# EAGLE design Atmega32u2.breakout (EAGLE 6.1)
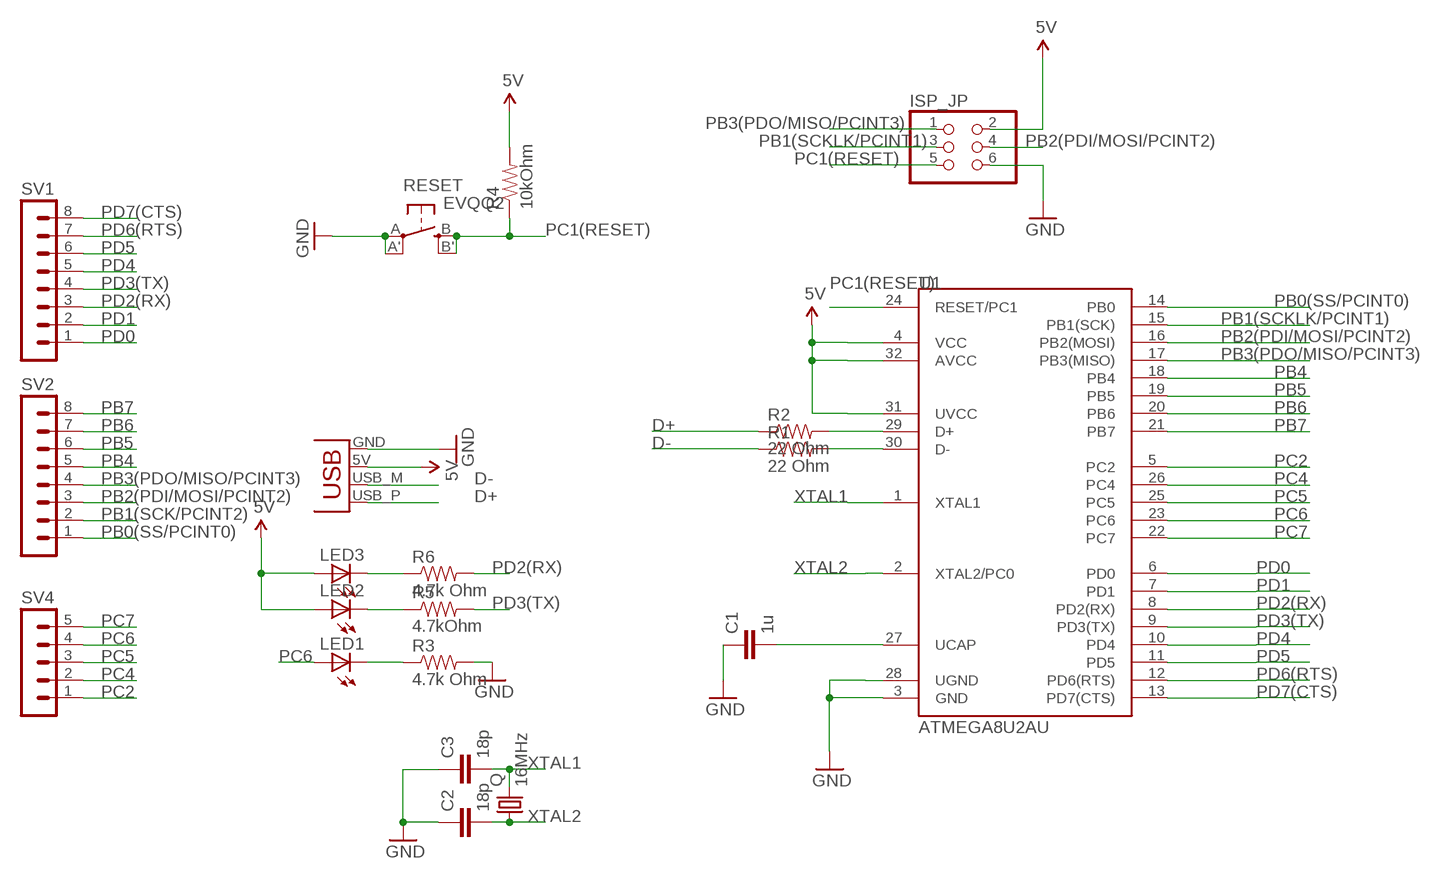
[diagram p0: schematic, sheet 1]

## Parts
C1  1u  CAP0805  [0805]
C2  18p  CAP0805  [0805]
C3  18p  CAP0805  [0805]
ISP_JP  PINHD-2X3  [2X03]
LED1  LED0603  [LED-0603]
LED2  LED0603  [LED-0603]
LED3  LED0603  [LED-0603]
Q  16MHz  CRYSTALHC49US  [HC49US]
R1  22 Ohm  RESISTOR  [0805]
R2  22 Ohm  RESISTOR  [0805]
R3  4.7k Ohm  RESISTOR  [0805]
R4  10kOhm  RESISTOR  [0805]
R5  4.7kOhm  RESISTOR  [0805]
R6  4.7k Ohm  RESISTOR  [0805]
RESET  EVQQ2  [EVQ-Q2]
SV1  MA08-1  [MA08-1]
SV2  MA08-1  [MA08-1]
SV4  MA05-1  [MA05-1]
U1  ATMEGA8U2AU  [TQFP32-08]
X1  USBPCB  [USB-A-PCB]

## Nets
5V: ISP_JP.2 LED2.A LED3.A R4.2 U1.4(VCC) U1.31(UVCC) U1.32(AVCC) X1.5V(VBUS)
D+: R2.1 X1.USB_P(D+)
D-: R1.1 X1.USB_M(D-)
GND: C1.1 C2.1 C3.1 ISP_JP.6 R3.2 RESET.A'(P1) RESET.A(P) U1.3(GND) U1.28(UGND) X1.GND
N$1: R2.2 U1.29(D+)
N$2: R1.2 U1.30(D-)
N$3: C1.2 U1.27(UCAP)
N$4: LED3.C R6.1
N$5: LED2.C R5.1
N$12: LED1.C R3.1
PB0(SS/PCINT0): SV2.1 U1.14(PB0)
PB1(SCK/PCINT2): SV2.2
PB1(SCKLK/PCINT1): ISP_JP.3 U1.15(PB1(SCK))
PB2(PDI/MOSI/PCINT2): ISP_JP.4 SV2.3 U1.16(PB2(MOSI))
PB3(PDO/MISO/PCINT3): ISP_JP.1 SV2.4 U1.17(PB3(MISO))
PB4: SV2.5 U1.18(PB4)
PB5: SV2.6 U1.19(PB5)
PB6: SV2.7 U1.20(PB6)
PB7: SV2.8 U1.21(PB7)
PC1(RESET): ISP_JP.5 R4.1 RESET.B'(S1) RESET.B(S) U1.24(RESET/PC1)
PC2: SV4.1 U1.5(PC2)
PC4: SV4.2 U1.26(PC4)
PC5: SV4.3 U1.25(PC5)
PC6: LED1.A SV4.4 U1.23(PC6)
PC7: SV4.5 U1.22(PC7)
PD0: SV1.1 U1.6(PD0)
PD1: SV1.2 U1.7(PD1)
PD2(RX): R6.2 SV1.3 U1.8(PD2(RX))
PD3(TX): R5.2 SV1.4 U1.9(PD3(TX))
PD4: SV1.5 U1.10(PD4)
PD5: SV1.6 U1.11(PD5)
PD6(RTS): SV1.7 U1.12(PD6(RTS))
PD7(CTS): SV1.8 U1.13(PD7(CTS))
XTAL1: C3.2 Q.2 U1.1(XTAL1)
XTAL2: C2.2 Q.1 U1.2(XTAL2/PC0)

## Library data of the parts
C1-C3 = SparkFun:CAP: Capacitor Standard 0603 ceramic capacitor, and 0.1" leaded capacitor.
ISP_JP = SparkFun:PINHD-2X3: PIN HEADER
LED1-LED3 = SparkFun:LED: LEDs Standard schematic elements and footprints for 5mm, 3mm, 1206, and 0603 sized LEDs. 5mm - Spark Fun Electronics SKU : COM-00529 (and others)
Q = SparkFun:CRYSTAL: Crystals Various standard crystals. Proven footprints. Spark Fun Electronics SKU : COM-00534
R1-R6 = SparkFun:RESISTOR: Resistor Basic schematic elements and footprints for 0603, 1206, and PTH 1/10th watt (small) resistors.
RESET = adaprog:EVQQ2
SV1 SV2 = con-lstb:MA08-1: PIN HEADER; OC_FARNELL: unknown; OC_NEWARK: unknown
SV4 = con-lstb:MA05-1: PIN HEADER; OC_FARNELL: unknown; OC_NEWARK: unknown
U1 = SparkFun:ATMEGA8U2: Atmel 8-bit Microcontroller with 8/16/32K Bystes of ISP Flash and USB Controller. ATmega8U2, ATmega16U2, and ATmega32U2
X1 = SparkFun:USB: USB Connectors USB-B-PTH is fully proven SKU : PRT-00139 USB-miniB is fully proven SKU : PRT-00587 USB-A-PCB is untested. USB-A-H is throughly reviewed, but untested. Spark Fun Electronics SKU : PRT-00437 USB-B-SMT is throughly reviewed, but untested. Needs silkscreen touching up. USB-A-S has not been used/tested USB-MB-H has not been used/tested

## Board
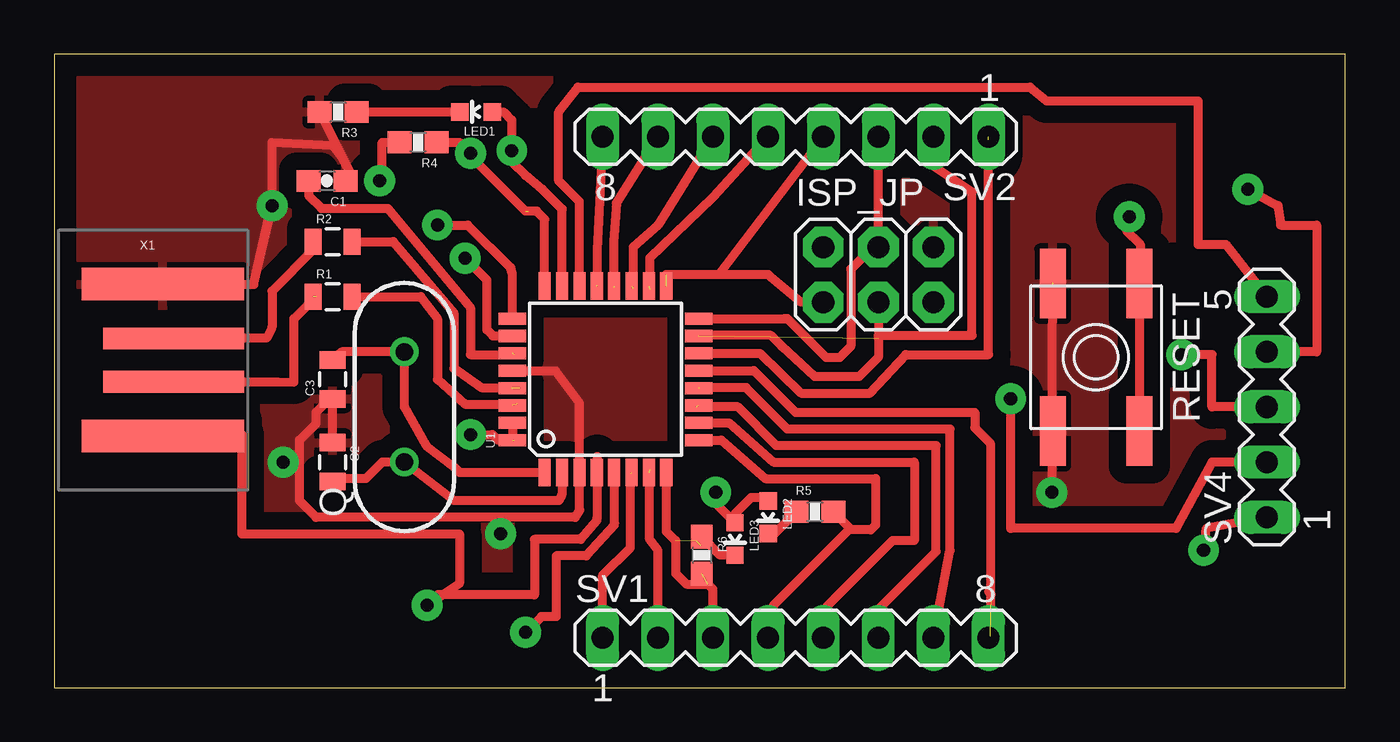
[diagram p1: board, top side]
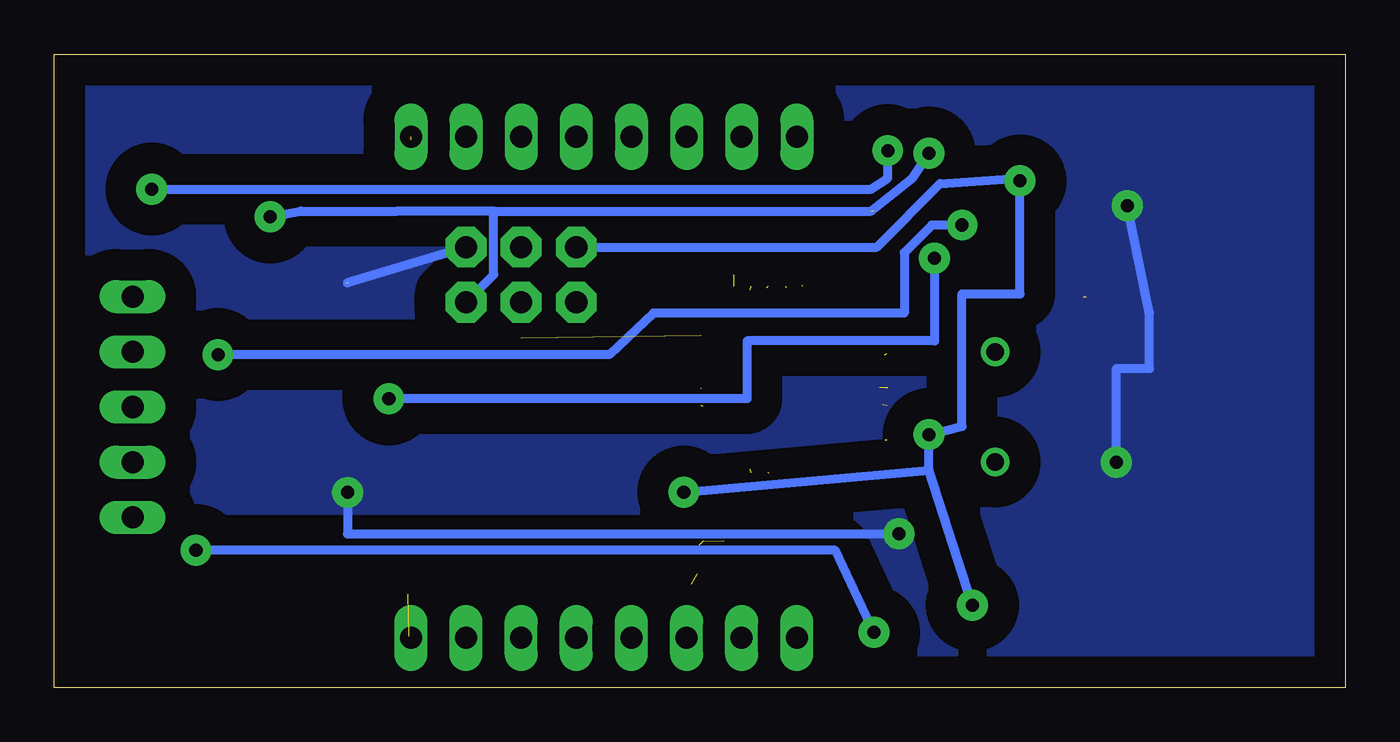
[diagram p2: board, bottom side, seen from below]

Size 59.49 x 29.18 mm. Coordinates in mm from the lower left corner, seen from the top.
Outline: 0,0 59.49,0 59.49,29.18 0,29.18 0,0
Copper layers (1*16): Top 0.035mm / dielectric 1.5mm / Bottom 0.035mm
Design rules: minimum track width 10mil, minimum drill 24mil, track to track 8mil, track to pad 8mil, pad to pad 8mil, via to via 8mil, smd to smd 8mil, copper to edge 40mil, drill to drill 8mil, minimum pad ring 10mil, minimum via ring 8mil, stop-mask expansion 4mil, vias tented up to drill 0mil, thermal gap 10mil

### Footprints (pad centres in the part's own frame; a part is rotated, then mirrored left to right if it is on the bottom)
0603-CAP = smd 1.1 x 1: 1 -0.85,0; 2 0.85,0
0805 = smd 0.8 x 1.2: 1 -0.9,0; 2 0.9,0
2X03 = drill 1.016 pad 1.88 octagon: 1 -2.54,-1.27; 2 -2.54,1.27; 3 0,-1.27; 4 0,1.27; 5 2.54,-1.27; 6 2.54,1.27
LED-0603 = smd 0.8 x 0.8: A 0,-0.75; C 0,0.75
HC49US = drill 0.813: 1 -2.54,0; 2 2.54,0
0603-RES = smd 1.1 x 1: 1 -0.85,0; 2 0.85,0
EVQ-Q2 = smd 3.2 x 1.2: A -3.4,-2; A' 3.4,-2; B -3.4,2; B' 3.4,2
MA08-1 = drill 1.016 long: 1 -8.89,0; 2 -6.35,0; 3 -3.81,0; 4 -1.27,0; 5 1.27,0; 6 3.81,0; 7 6.35,0; 8 8.89,0
MA05-1 = drill 1.016 long: 1 -5.08,0; 2 -2.54,0; 3 0,0; 4 2.54,0; 5 5.08,0
TQFP32-08 = smd 1.27 x 0.559: 1 -4.293,2.8; 2 -4.293,2; 3 -4.293,1.2; 4 -4.293,0.4; 5 -4.293,-0.4; 6 -4.293,-1.2; 7 -4.293,-2; 8 -4.293,-2.8; 17 4.293,-2.8; 18 4.293,-2; 19 4.293,-1.2; 20 4.293,-0.4; 21 4.293,0.4; 22 4.293,1.2; 23 4.293,2; 24 4.293,2.8 | smd 0.559 x 1.27: 9 -2.8,-4.293; 10 -2,-4.293; 11 -1.2,-4.293; 12 -0.4,-4.293; 13 0.4,-4.293; 14 1.2,-4.293; 15 2,-4.293; 16 2.8,-4.293; 25 2.8,4.293; 26 2,4.293; 27 1.2,4.293; 28 0.4,4.293; 29 -0.4,4.293; 30 -1.2,4.293; 31 -2,4.293; 32 -2.8,4.293
USB-A-PCB = smd 7.5 x 1.5: 5V -0.2,-3.5; GND -0.2,3.5 | smd 6.5 x 1: USB_M 0.3,-1; USB_P 0.3,1

### Placement (x,y rotation side)
C1  1u  [0603-CAP]  12.57,23.34 180 top
C2  12.83,10.39 270 top
C3  12.83,14.2 90 top
ISP_JP  37.97,19.03 0 top
LED1  19.43,26.52 90 top
LED2  32.89,7.85 180 top
LED3  31.37,6.85 180 top
Q  16.13,12.93 90 top
R1  12.83,18.01 0 top
R2  12.83,20.55 0 top
R3  4.7k Ohm  [0603-RES]  13.08,26.52 180 top
R4  10kOhm  [0603-RES]  16.76,25.12 180 top
R5  4.7kOhm  [0603-RES]  35.05,8.1 0 top
R6  4.7k Ohm  [0603-RES]  29.84,6.1 270 top
RESET  48.01,15.22 270 top
SV1  34.16,2.29 0 top
SV2  34.16,25.38 180 top
SV4  55.88,12.93 90 top
U1  25.4,14.2 90 top
X1  5.21,15.09 0 top

### Tracks (layer width: path | path; a pad name or v marks a point on that pad's centre or on a via)
5V  (via drill 0.6, 0.6 pad 1.42)  (1 unrouted)
  Top 0.406: v19.18,11.66 20.19,11.66 20.45,11.41 21.21,11.41 | X1.5V 8.64,11.66 8.65,8.53 8.64,7.09 18.67,7.09 18.67,4.8 v17.18,3.8 17.64,4.27 22.13,4.27 22.13,6.83 24.26,6.83 24.99,7.7 25,7.82 U1.4 25.02,10.01 25.02,10.64 | U1.32 U1.31 21.21,12.17 | R4.2 15.11,25.12 15.11,23.22 v14.99,23.34 | v30.48,9.01 30.48,8.49 LED3.A 31.37,8.01 32.13,8.77 32.72,8.77 LED2.A
  Bottom 0.406: v17.18,3.8 19.18,10.01 | 19.18,10.01 v19.18,11.66 17.65,12.04 17.65,18.14 14.99,18.14 v14.99,23.34 15.11,23.47 18.67,23.22 21.59,20.3 ISP_JP.2 | v30.48,9.01 19.18,10.01
D+
  Top 0.406: R2.1 11.98,20.21 10.03,18.26 10.03,16.61 9.78,16.11 7.3,16.11 X1.USB_P
D-  (1 unrouted)
  Top 0.406: X1.USB_M 10.3,14.09 11.05,14.07 11.05,16.99 12.07,18.01
GND  (via drill 0.6 pad 1.42)  (1 unrouted)
  Top 0.406: C2.1 C3.1 | 9.2,18.57 10.03,22.33 10.03,25.12 12.83,25 13.21,24.49 13.72,23.51 C1.1 13.68,23.6 R3.2 | 20.57,7.85 24,7.85 24.21,8.18 24.21,9.77 U1.3 24.2,13.11 23.11,14.58 21.51,14.58 U1.28 | 20.57,7.85 12.07,7.85 11.3,8.61 11.3,10.39 | 11.3,10.39 11.3,11.41 12.07,12.17 12.07,12.68 12.83,13.44 | v10.54,10.39 11.3,10.39 | X1.GND 9.2,18.57 | 9.2,18.57 v10.03,22.2 | v45.97,8.99 45.97,11.41 RESET.A | v20.57,7.09 20.57,7.85
  Bottom 0.406: v10.03,22.2 9.02,17.25 9.02,14.71 10.54,14.71 v10.54,10.39 | v20.57,7.09 45.97,7.09 v45.97,8.99 | ISP_JP.6 45.97,18.64
  pour Bottom (isolate 1.422): 0.25,28.93 59.31,28.93 59.31,0.25 0.25,0.25
  pour Top (isolate 0.813): 0.64,28.68 59.18,28.68 59.18,0.38 0.38,0.38 0.38,28.55
N$1  (2 unrouted)
  Top 0.406: R2.2 15.62,20.55 18.41,17.25 18.41,14.71 19.68,13.82 21.46,13.82
N$2  (1 unrouted)
  Top 0.406: R1.2 16.89,18.01 17.65,16.99 17.65,14.2 18.92,13.06 21.34,13.06
N$3  (1 unrouted)
  Top 0.406: C1.2 11.72,22.67 12.32,22.07 15.37,22.07 19.18,17.5 19.18,15.34 21.21,15.34
N$4
  Top 0.406: LED3.C 30.68,6.1 R6.1
N$5
  Top 0.406: LED2.C 33.2,7.1 R5.1
N$12
  Top 0.406: R3.1 LED1.C
PB0(SS/PCINT0)  (1 unrouted)
  Top 0.406: U1.14 32.51,15.4 34.42,13.56 37.59,13.56 39.24,15.34 43.05,15.34 43.05,25.25 | 43.18,25.25 SV2.1
PB1(SCK/PCINT2)
  Top 0.406: 29.97,16.23 33.02,16.23 33.53,15.72 35.05,14.33 37.08,14.33 37.97,15.22 37.97,16.23 42.29,16.23 42.29,22.84 40.39,24.11 40.39,25.25 SV2.2
PB1(SCKLK/PCINT1)  (1 unrouted)
  Top 0.406: ISP_JP.3 37.97,16.11
PB2(PDI/MOSI/PCINT2)
  Top 0.406: U1.16 33.65,17 33.66,16.99 33.78,16.99 35.56,15.22 36.2,15.22 36.7,15.72 36.7,19.28 37.72,20.3 ISP_JP.4 SV2.3
PB3(PDO/MISO/PCINT3)  (1 unrouted)
  Top 0.406: SV2.4 30.61,19.03 | 30.61,19.03 28.19,19.03 | ISP_JP.1 34.42,17.76 32.89,19.03 30.61,19.03
PB4  (1 unrouted)
  Top 0.406: SV2.5 30.35,22.58 27.43,19.79 27.43,18.34
PB5  (1 unrouted)
  Top 0.406: SV2.6 27.81,21.31 26.67,20.3 26.67,18.39
PB6  (1 unrouted)
  Top 0.406: SV2.7 25.91,22.33 25.78,20.55 25.78,18.42
PB7  (1 unrouted)
  Top 0.406: SV2.8 25.15,22.84 25.02,20.17 25.02,18.54
PC1(RESET)  (via drill 0.6 pad 1.42)  (1 unrouted)
  Top 0.406: v49.53,21.69 49.4,21.06 50.04,20.42 50.04,18.65 RESET.B RESET.B' | R4.1 18.67,25.12 v19.18,24.61 | U1.24 22.6,21.57 22.22,21.95 21.72,21.95 19.05,24.61
  Bottom 0.406: v19.18,24.61 19.94,23.47 21.84,21.95 39.24,21.95 | v49.53,21.69 48.13,21.95 43.69,21.95 42.16,21.95 39.24,21.95 | ISP_JP.5 39.24,19.03 39.24,21.95
PC2  (via drill 0.6 pad 1.42)
  Top 0.406: v52.96,6.33 53.09,7.34 SV4.1 | U1.5 25.8,7.63 25.81,7.49 24.51,6.07 23.13,6.07 23.13,3.27 22.45,3.27 v21.72,2.55
  Bottom 0.406: v52.96,6.33 23.49,6.33 v21.72,2.55
PC4  (via drill 0.6 pad 1.42)
  Top 0.406: v18.92,19.79 19.94,18.77 19.94,16.49 20.22,16.21 U1.26 | SV4.2 53.34,10.39 51.69,7.34 44.07,7.34 v44.07,13.31
  Bottom 0.406: v18.92,19.79 18.92,15.98 27.56,15.98 27.56,13.31 v44.07,13.31
PC5  (via drill 0.6 pad 1.42)
  Top 0.406: v17.65,21.31 19.05,21.31 21.03,19.35 21.11,19.05 U1.25 | SV4.3 53.34,12.93 53.34,15.34 v51.94,15.34
  Bottom 0.406: v51.94,15.34 33.91,15.34 31.88,17.25 20.32,17.25 20.32,20.04 19.05,21.31 v17.65,21.31
PC6  (via drill 0.6 pad 1.42)
  Top 0.406: v54.99,22.96 56.39,22.2 56.52,21.31 58.17,21.31 58.17,15.47 SV4.4 | U1.23 23.4,22.04 22.48,22.96 21.72,23.6 21.08,24.23 v21.08,24.74 21.08,26.14 20.7,26.52 LED1.A
  Bottom 0.406: v54.99,22.96 21.84,22.96 21.08,23.47 v21.08,24.74
PC7
  Top 0.406: SV4.5 53.98,20.42 52.71,20.42 52.71,27.03 45.72,27.03 44.96,27.66 24.13,27.66 23.24,26.52 23.24,23.34 24.2,22.38 U1.22 24.2,18.46 24.13,18.39
PD0  (1 unrouted)
  Top 0.406: SV1.1 25.27,5.18 26.54,6.45 26.54,9.88
PD1  (1 unrouted)
  Top 0.406: SV1.2 27.81,6.33 27.43,6.83 27.43,10.06
PD2(RX)  (3 unrouted)
  Top 0.406: U1.8 28.2,7.2 28.63,6.77 28.63,5.27 29.13,4.77 30.13,4.77 30.35,4.54 SV1.3
PD3(TX)
  Top 0.406: U1.9 30.74,11.4 32.77,9.63 37.85,9.63 37.85,7.49 37.63,7.27 36.63,7.27 | 36.63,7.27 33.13,3.77 33.13,2.53 SV1.4 | 36.63,7.27 36.63,7.38 R5.2
PD4
  Top 0.406: U1.10 31.08,12.2 33.15,10.39 39.63,10.39 39.63,6.77 38.63,6.77 35.63,3.77 35.63,2.49 SV1.5
PD5  (1 unrouted)
  Top 0.406: 29.59,12.93 31.5,12.93 33.27,11.15 40.64,11.15 40.63,11.14 40.63,6.27 37.97,3.62 SV1.6
PD6(RTS)  (1 unrouted)
  Top 0.406: SV1.7 41.28,6.33 41.28,11.91 33.78,11.91 31.88,13.82 29.72,13.82
PD7(CTS)  (1 unrouted)
  Top 0.406: U1.13 32.24,14.6 34.16,12.68 42.42,12.68 42.42,11.98 43.13,11.27 43.13,2.37 SV1.8 | 43.05,4.42 43.18,4.29
XTAL1
  Top 0.406: C3.2 13.25,15.47 Q.2 16.13,12.93 17.14,11.15 18.47,10.14 18.69,9.91 U1.1
XTAL2
  Top 0.406: C2.2 12.92,9.63 14.35,9.63 15.11,10.39 Q.1 18.41,8.61 23.24,8.61 23.39,8.89 23.4,9.01 U1.2